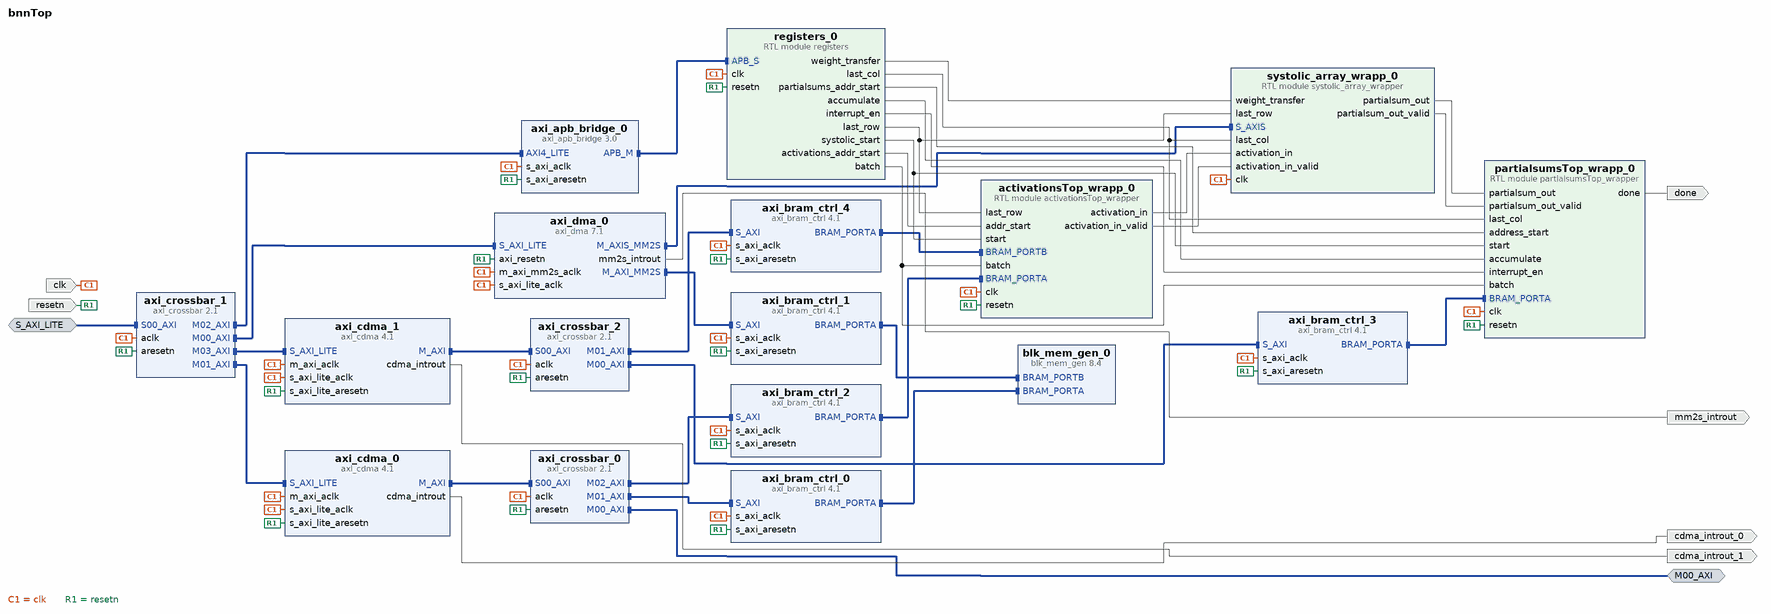
[diagram p0: block diagram of the top level]
# Vivado block design bnnTop, xczu7ev-ffvc1156-2-e, Vivado 2020.1
create_bd_design bnnTop

create_bd_intf_port -mode Slave -vlnv xilinx.com:interface:aximm_rtl:1.0 S_AXI_LITE
set_property -dict [list \
  CONFIG.DATA_WIDTH 32 \
  CONFIG.PROTOCOL AXI4LITE \
  CONFIG.ID_WIDTH 0 \
  CONFIG.ADDR_WIDTH 32 \
  CONFIG.AWUSER_WIDTH 0 \
  CONFIG.ARUSER_WIDTH 0 \
  CONFIG.WUSER_WIDTH 0 \
  CONFIG.RUSER_WIDTH 0 \
  CONFIG.BUSER_WIDTH 0 \
  CONFIG.READ_WRITE_MODE READ_WRITE \
  CONFIG.HAS_BURST 1 \
  CONFIG.HAS_LOCK 1 \
  CONFIG.HAS_PROT 1 \
  CONFIG.HAS_CACHE 1 \
  CONFIG.HAS_QOS 1 \
  CONFIG.HAS_REGION 0 \
  CONFIG.HAS_WSTRB 1 \
  CONFIG.HAS_BRESP 1 \
  CONFIG.HAS_RRESP 1 \
  CONFIG.SUPPORTS_NARROW_BURST 0 \
  CONFIG.NUM_READ_OUTSTANDING 2 \
  CONFIG.NUM_WRITE_OUTSTANDING 2 \
  CONFIG.MAX_BURST_LENGTH 1 \
  CONFIG.NUM_READ_THREADS 1 \
  CONFIG.NUM_WRITE_THREADS 1 \
  CONFIG.RUSER_BITS_PER_BYTE 0 \
  CONFIG.WUSER_BITS_PER_BYTE 0 \
] [get_bd_intf_ports S_AXI_LITE]
create_bd_intf_port -mode Master -vlnv xilinx.com:interface:aximm_rtl:1.0 M00_AXI
set_property -dict [list \
  CONFIG.DATA_WIDTH 128 \
  CONFIG.PROTOCOL AXI4 \
  CONFIG.ADDR_WIDTH 32 \
  CONFIG.HAS_BURST 0 \
  CONFIG.HAS_LOCK 0 \
  CONFIG.HAS_QOS 0 \
  CONFIG.HAS_REGION 0 \
  CONFIG.NUM_READ_OUTSTANDING 2 \
  CONFIG.NUM_WRITE_OUTSTANDING 2 \
] [get_bd_intf_ports M00_AXI]
create_bd_port -dir I -type clk clk
set_property -dict [list \
  CONFIG.ASSOCIATED_BUSIF S_AXI_LITE:M00_AXI \
  CONFIG.ASSOCIATED_RESET resetn \
  CONFIG.FREQ_HZ 100000000 \
] [get_bd_ports clk]
create_bd_port -dir I -type rst resetn
create_bd_port -dir O -type intr cdma_introut_0
create_bd_port -dir O -type intr done
create_bd_port -dir O -type intr cdma_introut_1
create_bd_port -dir O -type intr mm2s_introut

create_bd_cell -type ip -vlnv xilinx.com:ip:blk_mem_gen:8.4 blk_mem_gen_0
set_property -dict [list \
  CONFIG.Assume_Synchronous_Clk true \
  CONFIG.EN_SAFETY_CKT true \
  CONFIG.Enable_32bit_Address true \
  CONFIG.Enable_B Use_ENB_Pin \
  CONFIG.Memory_Type True_Dual_Port_RAM \
  CONFIG.Port_B_Clock 100 \
  CONFIG.Port_B_Enable_Rate 100 \
  CONFIG.Port_B_Write_Rate 50 \
  CONFIG.Register_PortA_Output_of_Memory_Primitives false \
  CONFIG.Register_PortB_Output_of_Memory_Primitives false \
  CONFIG.Use_RSTA_Pin true \
  CONFIG.Use_RSTB_Pin true \
  CONFIG.use_bram_block BRAM_Controller \
] [get_bd_cells blk_mem_gen_0]
create_bd_cell -type ip -vlnv xilinx.com:ip:axi_bram_ctrl:4.1 axi_bram_ctrl_0
set_property -dict {CONFIG.DATA_WIDTH 128 CONFIG.SINGLE_PORT_BRAM 1} [get_bd_cells axi_bram_ctrl_0]
create_bd_cell -type ip -vlnv xilinx.com:ip:axi_bram_ctrl:4.1 axi_bram_ctrl_1
set_property -dict {CONFIG.DATA_WIDTH 128 CONFIG.SINGLE_PORT_BRAM 1} [get_bd_cells axi_bram_ctrl_1]
create_bd_cell -type ip -vlnv xilinx.com:ip:axi_dma:7.1 axi_dma_0
set_property -dict [list \
  CONFIG.c_include_s2mm 0 \
  CONFIG.c_include_sg 0 \
  CONFIG.c_m_axi_mm2s_data_width 128 \
  CONFIG.c_m_axis_mm2s_tdata_width 128 \
  CONFIG.c_micro_dma 0 \
  CONFIG.c_mm2s_burst_size 32 \
] [get_bd_cells axi_dma_0]
create_bd_cell -type ip -vlnv xilinx.com:ip:axi_crossbar:2.1 axi_crossbar_0
set_property -dict {CONFIG.M01_S00_READ_CONNECTIVITY 0 CONFIG.NUM_MI 3 CONFIG.STRATEGY 2} [get_bd_cells axi_crossbar_0]
create_bd_cell -type ip -vlnv xilinx.com:ip:axi_crossbar:2.1 axi_crossbar_1
set_property -dict {CONFIG.NUM_MI 4 CONFIG.STRATEGY 1} [get_bd_cells axi_crossbar_1]
create_bd_cell -type ip -vlnv xilinx.com:ip:axi_apb_bridge:3.0 axi_apb_bridge_0
set_property -dict {CONFIG.C_APB_NUM_SLAVES 1} [get_bd_cells axi_apb_bridge_0]
create_bd_cell -type ip -vlnv xilinx.com:ip:axi_bram_ctrl:4.1 axi_bram_ctrl_2
set_property -dict {CONFIG.DATA_WIDTH 128 CONFIG.READ_LATENCY 3 CONFIG.SINGLE_PORT_BRAM 1} [get_bd_cells axi_bram_ctrl_2]
create_bd_cell -type ip -vlnv xilinx.com:ip:axi_cdma:4.1 axi_cdma_1
set_property -dict [list \
  CONFIG.C_INCLUDE_SG 0 \
  CONFIG.C_M_AXI_DATA_WIDTH 256 \
  CONFIG.C_M_AXI_MAX_BURST_LEN 128 \
  CONFIG.C_USE_DATAMOVER_LITE 0 \
] [get_bd_cells axi_cdma_1]
create_bd_cell -type ip -vlnv xilinx.com:ip:axi_bram_ctrl:4.1 axi_bram_ctrl_3
set_property -dict {CONFIG.DATA_WIDTH 256 CONFIG.READ_LATENCY 2 CONFIG.SINGLE_PORT_BRAM 1} [get_bd_cells axi_bram_ctrl_3]
create_bd_cell -type ip -vlnv xilinx.com:ip:axi_crossbar:2.1 axi_crossbar_2
set_property -dict [list \
  CONFIG.M00_S00_WRITE_CONNECTIVITY 0 \
  CONFIG.M01_S00_READ_CONNECTIVITY 0 \
  CONFIG.STRATEGY 2 \
] [get_bd_cells axi_crossbar_2]
create_bd_cell -type ip -vlnv xilinx.com:ip:axi_bram_ctrl:4.1 axi_bram_ctrl_4
set_property -dict {CONFIG.DATA_WIDTH 256 CONFIG.SINGLE_PORT_BRAM 1} [get_bd_cells axi_bram_ctrl_4]
create_bd_cell -type ip -vlnv xilinx.com:ip:axi_cdma:4.1 axi_cdma_0
set_property -dict [list \
  CONFIG.C_INCLUDE_SG 0 \
  CONFIG.C_M_AXI_DATA_WIDTH 128 \
  CONFIG.C_M_AXI_MAX_BURST_LEN 256 \
  CONFIG.C_USE_DATAMOVER_LITE 0 \
] [get_bd_cells axi_cdma_0]
create_bd_cell -type module -reference registers registers_0
create_bd_cell -type module -reference activationsTop_wrapper activationsTop_wrapp_0
create_bd_cell -type module -reference partialsumsTop_wrapper partialsumsTop_wrapp_0
create_bd_cell -type module -reference systolic_array_wrapper systolic_array_wrapp_0

# ---- connections ----

connect_bd_intf_net [get_bd_intf_pins axi_bram_ctrl_2/S_AXI] [get_bd_intf_pins axi_crossbar_0/M02_AXI]
connect_bd_intf_net [get_bd_intf_pins axi_crossbar_1/M01_AXI] [get_bd_intf_pins axi_cdma_0/S_AXI_LITE]
connect_bd_intf_net [get_bd_intf_pins axi_apb_bridge_0/APB_M] [get_bd_intf_pins registers_0/APB_S]
connect_bd_intf_net [get_bd_intf_pins axi_bram_ctrl_4/BRAM_PORTA] [get_bd_intf_pins activationsTop_wrapp_0/BRAM_PORTB]
connect_bd_intf_net [get_bd_intf_pins systolic_array_wrapp_0/S_AXIS] [get_bd_intf_pins axi_dma_0/M_AXIS_MM2S]
connect_bd_intf_net [get_bd_intf_pins axi_crossbar_1/M00_AXI] [get_bd_intf_pins axi_dma_0/S_AXI_LITE]
connect_bd_intf_net [get_bd_intf_pins axi_bram_ctrl_0/BRAM_PORTA] [get_bd_intf_pins blk_mem_gen_0/BRAM_PORTA]
connect_bd_intf_net [get_bd_intf_pins axi_crossbar_2/M01_AXI] [get_bd_intf_pins axi_bram_ctrl_4/S_AXI]
connect_bd_intf_net [get_bd_intf_pins axi_dma_0/M_AXI_MM2S] [get_bd_intf_pins axi_bram_ctrl_1/S_AXI]
connect_bd_intf_net [get_bd_intf_pins axi_bram_ctrl_3/BRAM_PORTA] [get_bd_intf_pins partialsumsTop_wrapp_0/BRAM_PORTA]
connect_bd_intf_net [get_bd_intf_pins axi_crossbar_0/M01_AXI] [get_bd_intf_pins axi_bram_ctrl_0/S_AXI]
connect_bd_intf_net -intf_net S00_AXI_0_1 [get_bd_intf_ports S_AXI_LITE] [get_bd_intf_pins axi_crossbar_1/S00_AXI]
connect_bd_intf_net [get_bd_intf_pins axi_crossbar_2/M00_AXI] [get_bd_intf_pins axi_bram_ctrl_3/S_AXI]
connect_bd_intf_net [get_bd_intf_pins axi_crossbar_2/S00_AXI] [get_bd_intf_pins axi_cdma_1/M_AXI]
connect_bd_intf_net [get_bd_intf_pins axi_bram_ctrl_1/BRAM_PORTA] [get_bd_intf_pins blk_mem_gen_0/BRAM_PORTB]
connect_bd_intf_net [get_bd_intf_pins axi_cdma_0/M_AXI] [get_bd_intf_pins axi_crossbar_0/S00_AXI]
connect_bd_intf_net [get_bd_intf_ports M00_AXI] [get_bd_intf_pins axi_crossbar_0/M00_AXI]
connect_bd_intf_net [get_bd_intf_pins activationsTop_wrapp_0/BRAM_PORTA] [get_bd_intf_pins axi_bram_ctrl_2/BRAM_PORTA]
connect_bd_intf_net [get_bd_intf_pins axi_cdma_1/S_AXI_LITE] [get_bd_intf_pins axi_crossbar_1/M03_AXI]
connect_bd_intf_net [get_bd_intf_pins axi_apb_bridge_0/AXI4_LITE] [get_bd_intf_pins axi_crossbar_1/M02_AXI]
connect_bd_net [get_bd_ports clk] \
  [get_bd_pins axi_bram_ctrl_0/s_axi_aclk] [get_bd_pins axi_crossbar_0/aclk] [get_bd_pins axi_bram_ctrl_1/s_axi_aclk] \
  [get_bd_pins axi_dma_0/m_axi_mm2s_aclk] [get_bd_pins axi_crossbar_1/aclk] [get_bd_pins axi_dma_0/s_axi_lite_aclk] \
  [get_bd_pins axi_apb_bridge_0/s_axi_aclk] [get_bd_pins axi_bram_ctrl_2/s_axi_aclk] [get_bd_pins axi_bram_ctrl_3/s_axi_aclk] \
  [get_bd_pins axi_crossbar_2/aclk] [get_bd_pins axi_bram_ctrl_4/s_axi_aclk] [get_bd_pins axi_cdma_1/m_axi_aclk] \
  [get_bd_pins axi_cdma_1/s_axi_lite_aclk] [get_bd_pins axi_cdma_0/m_axi_aclk] [get_bd_pins axi_cdma_0/s_axi_lite_aclk] \
  [get_bd_pins registers_0/clk] [get_bd_pins activationsTop_wrapp_0/clk] [get_bd_pins partialsumsTop_wrapp_0/clk] \
  [get_bd_pins systolic_array_wrapp_0/clk]
connect_bd_net [get_bd_ports resetn] \
  [get_bd_pins axi_bram_ctrl_0/s_axi_aresetn] [get_bd_pins axi_crossbar_0/aresetn] \
  [get_bd_pins axi_bram_ctrl_1/s_axi_aresetn] [get_bd_pins axi_crossbar_1/aresetn] [get_bd_pins axi_dma_0/axi_resetn] \
  [get_bd_pins axi_apb_bridge_0/s_axi_aresetn] [get_bd_pins axi_bram_ctrl_2/s_axi_aresetn] \
  [get_bd_pins axi_bram_ctrl_3/s_axi_aresetn] [get_bd_pins axi_crossbar_2/aresetn] \
  [get_bd_pins axi_bram_ctrl_4/s_axi_aresetn] [get_bd_pins axi_cdma_1/s_axi_lite_aresetn] \
  [get_bd_pins axi_cdma_0/s_axi_lite_aresetn] [get_bd_pins registers_0/resetn] [get_bd_pins activationsTop_wrapp_0/resetn] \
  [get_bd_pins partialsumsTop_wrapp_0/resetn]
connect_bd_net [get_bd_pins registers_0/last_row] [get_bd_pins activationsTop_wrapp_0/last_row] [get_bd_pins systolic_array_wrapp_0/last_row]
connect_bd_net [get_bd_pins registers_0/last_col] [get_bd_pins partialsumsTop_wrapp_0/last_col] [get_bd_pins systolic_array_wrapp_0/last_col]
connect_bd_net [get_bd_pins registers_0/systolic_start] [get_bd_pins activationsTop_wrapp_0/start] [get_bd_pins partialsumsTop_wrapp_0/start]
connect_bd_net [get_bd_pins registers_0/batch] [get_bd_pins activationsTop_wrapp_0/batch] [get_bd_pins partialsumsTop_wrapp_0/batch]
connect_bd_net [get_bd_pins registers_0/activations_addr_start] [get_bd_pins activationsTop_wrapp_0/addr_start]
connect_bd_net [get_bd_pins registers_0/partialsums_addr_start] [get_bd_pins partialsumsTop_wrapp_0/address_start]
connect_bd_net [get_bd_pins registers_0/accumulate] [get_bd_pins partialsumsTop_wrapp_0/accumulate]
connect_bd_net [get_bd_pins registers_0/interrupt_en] [get_bd_pins partialsumsTop_wrapp_0/interrupt_en]
connect_bd_net [get_bd_pins systolic_array_wrapp_0/partialsum_out] [get_bd_pins partialsumsTop_wrapp_0/partialsum_out]
connect_bd_net [get_bd_pins systolic_array_wrapp_0/partialsum_out_valid] [get_bd_pins partialsumsTop_wrapp_0/partialsum_out_valid]
connect_bd_net [get_bd_pins registers_0/weight_transfer] [get_bd_pins systolic_array_wrapp_0/weight_transfer]
connect_bd_net [get_bd_pins activationsTop_wrapp_0/activation_in] [get_bd_pins systolic_array_wrapp_0/activation_in]
connect_bd_net [get_bd_pins activationsTop_wrapp_0/activation_in_valid] [get_bd_pins systolic_array_wrapp_0/activation_in_valid]
connect_bd_net [get_bd_pins axi_cdma_0/cdma_introut] [get_bd_ports cdma_introut_0]
connect_bd_net [get_bd_pins partialsumsTop_wrapp_0/done] [get_bd_ports done]
connect_bd_net [get_bd_pins axi_cdma_1/cdma_introut] [get_bd_ports cdma_introut_1]
connect_bd_net [get_bd_pins axi_dma_0/mm2s_introut] [get_bd_ports mm2s_introut]

# ---- address map ----
assign_bd_address -offset 0x40000000 -range 128K -target_address_space [get_bd_addr_spaces axi_cdma_0/Data] [get_bd_addr_segs axi_bram_ctrl_2/S_AXI/Mem0]
assign_bd_address -offset 0x40040000 -range 4K -target_address_space [get_bd_addr_spaces axi_cdma_0/Data] [get_bd_addr_segs axi_bram_ctrl_0/S_AXI/Mem0]
assign_bd_address -offset 0x80000000 -range 1G -target_address_space [get_bd_addr_spaces axi_cdma_0/Data] [get_bd_addr_segs M00_AXI/Reg]
assign_bd_address -offset 0x40000000 -range 128K -target_address_space [get_bd_addr_spaces axi_cdma_1/Data] [get_bd_addr_segs axi_bram_ctrl_4/S_AXI/Mem0]
assign_bd_address -offset 0x40020000 -range 128K -target_address_space [get_bd_addr_spaces axi_cdma_1/Data] [get_bd_addr_segs axi_bram_ctrl_3/S_AXI/Mem0]
assign_bd_address -offset 0x40040000 -range 4K -target_address_space [get_bd_addr_spaces axi_dma_0/Data_MM2S] [get_bd_addr_segs axi_bram_ctrl_1/S_AXI/Mem0]
assign_bd_address -offset 0xC0000000 -range 64K -target_address_space [get_bd_addr_spaces S_AXI_LITE] [get_bd_addr_segs axi_cdma_0/S_AXI_LITE/Reg]
assign_bd_address -offset 0xC0010000 -range 64K -target_address_space [get_bd_addr_spaces S_AXI_LITE] [get_bd_addr_segs axi_cdma_1/S_AXI_LITE/Reg]
assign_bd_address -offset 0xC0020000 -range 64K -target_address_space [get_bd_addr_spaces S_AXI_LITE] [get_bd_addr_segs axi_dma_0/S_AXI_LITE/Reg]
assign_bd_address -offset 0xC0030000 -range 64K -target_address_space [get_bd_addr_spaces S_AXI_LITE] [get_bd_addr_segs registers_0/APB_S/Reg]

validate_bd_design
save_bd_design
